# Altium schematic sheet Debug.SchDoc
size A4
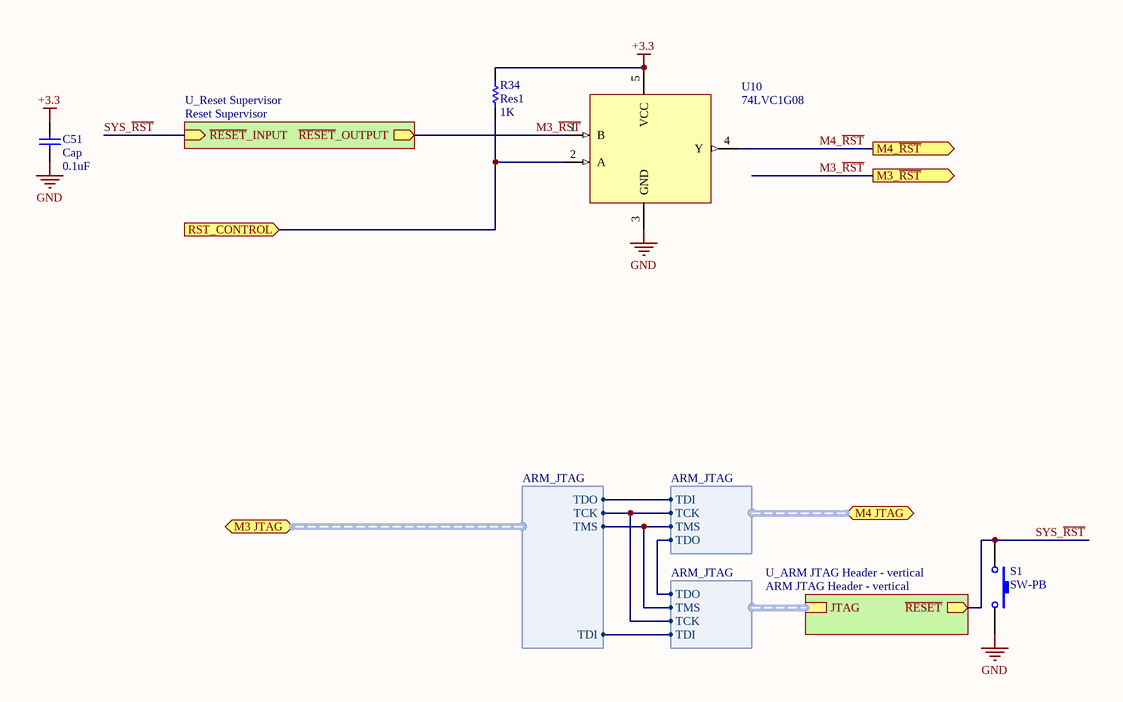
[diagram p0: Debug.SchDoc]

## Parts
C51  Cap  value 0.1uF  [C0603]
R34  Res1  value 1K  [R0603]
S1  SW-PB  [DTSM-32S-B]
U10  74LVC1G08  [SOT23127P600-8N]

## Sub-sheets
U_ARM JTAG Header - vertical = ARM JTAG Header - vertical: JTAG (harness ARM_JTAG), ~{RESET} (out)
U_Reset Supervisor = Reset Supervisor: ~{RESET}_OUTPUT (out), ~{RESET}_INPUT (in)

## Ports
M3 JTAG (harness ARM_JTAG), M3_~{RST} (out), M4 JTAG (harness ARM_JTAG), M4_~{RST} (out), RST_CONTROL (in)

## Harnesses
ARM_JTAG: TCK, TDI, TDO, TMS

## Nets
+3.3: C51.1 R34.2 U10.5(VCC)
GND: C51.2 S1.2 U10.3(GND)
M3_~{RST}: U10.1(B) ; port M3_~{RST}, sheet U_Reset Supervisor/~{RESET}_OUTPUT
M4_~{RST}: U10.4(Y) ; port M4_~{RST}
RST_CONTROL: R34.1 U10.2(A) ; port RST_CONTROL
SYS_~{RST}: S1.1 ; sheet U_Reset Supervisor/~{RESET}_INPUT, sheet U_ARM JTAG Header - vertical/~{RESET}
(unnamed): port M3 JTAG.TCK, port M4 JTAG.TCK, sheet U_ARM JTAG Header - vertical/JTAG.TCK
(unnamed): port M3 JTAG.TDI, sheet U_ARM JTAG Header - vertical/JTAG.TDI
(unnamed): port M3 JTAG.TDO, port M4 JTAG.TDI
(unnamed): port M3 JTAG.TMS, port M4 JTAG.TMS, sheet U_ARM JTAG Header - vertical/JTAG.TMS
(unnamed): port M4 JTAG.TDO, sheet U_ARM JTAG Header - vertical/JTAG.TDO

## Library data of the parts
C51 = Cap: Capacitor; Published: 8-Jun-2000; LatestRevisionDate: 17-Jul-2002; LatestRevisionNote: Re-released for DXP Platform.; PackageReference: RAD-0.3; Publisher: Altium Limited
R34 = Res1: Resistor; Published: 8-Jun-2000; LatestRevisionDate: 17-Jul-2002; LatestRevisionNote: Re-released for DXP Platform.; PackageReference: AXIAL-0.3; Publisher: Altium Limited
S1 = SW-PB: Switch; Published: 24-Mar-1999; LatestRevisionDate: 17-Jul-2002; LatestRevisionNote: Re-released for DXP Platform.; PackageReference: SPST-2; Publisher: Altium Limited
U10 = 74LVC1G08: farnell: 1631684